# Altium schematic sheet BoomIMU_Sensor.SchDoc
size A
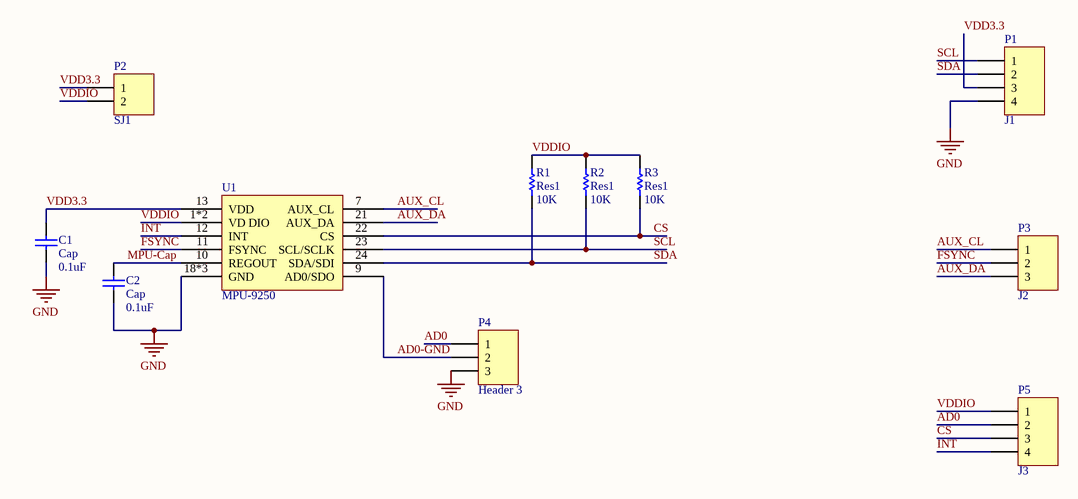
[diagram p0: BoomIMU_Sensor.SchDoc]

## Parts
C1  Cap  value 0.1uF  [C1206]
C2  Cap  value 0.1uF  [C1206]
P1  J1  [HDR1X4]
P2  SJ1  [HDR1X2]
P3  J2  [HDR1X3]
P4  Header 3  [HDR1X3]
P5  J3  [HDR1X4]
R1  Res1  value 10K  [C1206]
R2  Res1  value 10K  [C1206]
R3  Res1  value 10K  [C1206]
U1  MPU-9250  [MPU-9250]

## Nets
GND: C1.1 C2.1 P1.4 P4.3 U1.18*3(GND)
AD0: P4.1 P5.2
AD0-GND: P4.2 U1.9(AD0/SDO)
AUX_CL: P3.1 U1.7(AUX_CL)
AUX_DA: P3.3 U1.21(AUX_DA)
CS: P5.3 R3.1 U1.22(CS)
FSYNC: P3.2 U1.11(FSYNC)
INT: P5.4 U1.12(INT)
MPU-Cap: C2.2 U1.10(REGOUT)
SCL: P1.1 R2.1 U1.23(SCL/SCLK)
SDA: P1.2 R1.1 U1.24(SDA/SDI)
VDD3.3: C1.2 P1.3 P2.1 U1.13(VDD)
VDDIO: P2.2 P5.1 R1.2 R2.2 R3.2 U1.1*2(VD_DIO)

## Library data of the parts
C1 C2 = Cap: Capacitor; Published: 8-Jun-2000; LatestRevisionDate: 17-Jul-2002; LatestRevisionNote: Re-released for DXP Platform.; PackageReference: RAD-0.3; Publisher: Altium Limited; PackageDescription: Radial Cap, Thru-Hole; 2 Leads; 0.3 in Pin Spacing
P1 P5 = Header 4: Header, 4-Pin; LatestRevisionDate: 17-Jul-2002; LatestRevisionNote: Re-released for DXP Platform.; Publisher: Altium Limited
P2 = Header 2: Header, 2-Pin; LatestRevisionDate: 17-Jul-2002; LatestRevisionNote: Re-released for DXP Platform.; Publisher: Altium Limited
P3 P4 = Header 3: Header, 3-Pin; LatestRevisionDate: 17-Jul-2002; LatestRevisionNote: Re-released for DXP Platform.; Publisher: Altium Limited
R1-R3 = Res1: Resistor; Published: 8-Jun-2000; LatestRevisionDate: 17-Jul-2002; LatestRevisionNote: Re-released for DXP Platform.; PackageReference: AXIAL-0.3; Publisher: Altium Limited; PackageDescription: Axial Device, Thru-Hole; 2 Leads; 0.3 in Pin Spacing
U1 = MPU-9250: pin to pad: 1*2>1 18*3>18